# Altium schematic sheet System Power Supply.SchDoc
size A4
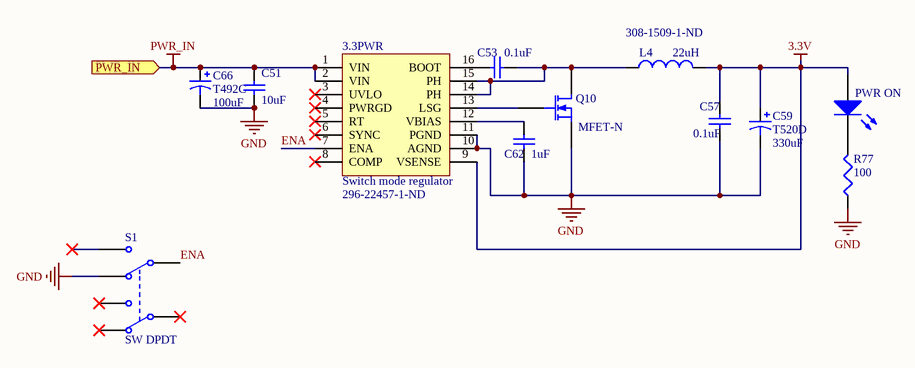
[diagram p0: System Power Supply.SchDoc]

## Parts
3.3PWR  Switch mode regulator  [TSOP65P640X120_HS-16N]
C51  value 10uF  [0603_CAP]  (hidden comment: X7R Cap)
C53  value 0.1uF  [0603_CAP]  (hidden comment: X7R Cap)
C57  value 0.1uF  [0603_CAP]  (hidden comment: X7R Cap)
C59  T520D  value 330uF  [D]
C62  value 1uF  [0603_CAP]  (hidden comment: X7R Cap)
C66  T492C  value 100uF  [C]
L4  value 22uH  Supplier Part Number 2: 308-1509-1-ND  [INDM7575X45N]  (hidden comment: Inductor)
PWR_ON  LED0  [0603_RES]  (value not drawn)
Q10  MFET-N  [CSD16321Q5]
R77  value 100  [0603_RES]  (hidden comment: Rpull)
S1  SW DPDT  [SPDT]

## Ports
PWR_IN (in)

## Nets
3.3V: 3.3PWR.9(VSENSE) C57.2 C59.1 L4.2 PWR_ON.1(A)
GND: 3.3PWR.10(AGND) 3.3PWR.11(PGND) C51.1 C57.1 C59.2 C62.2 C66.2 Q10.3(S) R77.1 S1.4(NC2)
PWR_IN: 3.3PWR.1(VIN) 3.3PWR.2(VIN) C51.2 C66.1 ; port PWR_IN
ENA: 3.3PWR.7(ENA) S1.5(COMMON2)
Net3.3PWR_12: 3.3PWR.12(VBIAS) C62.1
Net3.3PWR_13: 3.3PWR.13(LSG) Q10.2(G)
Net3.3PWR_14: 3.3PWR.14(PH) 3.3PWR.15(PH) C53.1 L4.1 Q10.1(D)
Net3.3PWR_16: 3.3PWR.16(BOOT) C53.2
NetPWR_ON_2: PWR_ON.2(K) R77.2

Not connected (* = marked no-connect by the designer): 3.3PWR 3(UVLO)* 4(PWRGD)* 5(RT)* 6(SYNC)* 8(COMP)*; S1 1(COMMON1)* 2(NC1)* 3(NO1)* 6(NO2)*

## Library data of the parts
3.3PWR = TPS54356: 296-22457-1-ND; Manufacturer: Texas Instruments; Manufacturer Part Number: TPS54356MPWPREP; Description: IC BUCK SYNC 3.3V 3A 16HTSSOP; Output Type: Fixed; Number of Outputs: 1; Voltage - Output: 3.3V; Voltage - Input: 5.5 V ~ 20 V; Frequency - Switching: 250kHz, 500kHz; Current - Output: 3A; Synchronous Rectifier: Yes; Supplier 1: Digi-Key; RoHS: RoHS Compliant; Category: Integrated Circuits (ICs); Stock 1: 4016; Pricing 1: 1=10.34, 25=8.58, 100=7.8, 250=7.02, 500=6.435, 1000=5.655 (USD); Type: Step-Down (Buck); PWM Type: -; Operating Temperature: -55°C ~ 125°C; Mounting Type: Surface Mount; Package / Case: 16-TSSOP (0.173", 4.40mm Width) Exposed pad; Packaging: Cut Tape (CT); Supplier Device Package: 16-HTSSOP; ComponentLink1URL: http://www.ti.com/lit/ds/symlink/tps54354-ep.pdf; ComponentLink1Description: http://www.ti.com/lit/ds/symlink/tps54354-ep.pdf; Supplier Part Number 1: 296-22457-1-ND
C51 C53 C57 C62 = Cap: Capacitor; Published: 8-Jun-2000; LatestRevisionDate: 17-Jul-2002; LatestRevisionNote: Re-released for DXP Platform.; PackageReference: RAD-0.3; Publisher: Altium Limited
C59 = T520D: Polymer Tantalum Chip Capacitor, T520 Series - KO-CAP Polymer; Published: 17-Jul-2002; LatestRevisionDate: 19-Mar-2004; LatestRevisionNote: Silkscreen dimensions re-sized.; DatasheetDocument: Mar-2001; PackageDocument: Mar-2001; PackageReference: D; Publisher: Altium Limited; Code_JEITA: 7343-31; ComponentLink1Description: Manufacturer Link; ComponentLink1URL: http://www.kemet.com/; ComponentLink2Description: Datasheet; ComponentLink2URL: http://www.kemet.com/kemet/web/homepage/kechome.nsf/vapubfilesname/F3102TA.pdf/$file/F3102TA.pdf
C66 = T492C: Solid Tantalum Chip Capacitor, T492 Series - CWR11 Style Per Mil-PRF-55365/8; Manufacturer: Kemet; Manufacturer Part Number: T491C107K016ZT; Description: CAP TANT 100UF 16V 10% 2312; Capacitance: 100µF; Voltage - Rated: 16V; Tolerance: ±10%; ESR (Equivalent Series Resistance): 1.000 Ohm; Type: Molded; Published: 17-Jul-2002; LatestRevisionDate: 19-Mar-2004; LatestRevisionNote: Silkscreen dimensions re-sized.; DatasheetDocument: Mar-2001; PackageDocument: Mar-2001; PackageReference: C; Publisher: Altium Limited; Code_JEITA: 6032-28; ComponentLink1Description: Manufacturer Link; ComponentLink1URL: http://www.kemet.com/; ComponentLink2Description: Datasheet; ComponentLink2URL: http://www.kemet.com/kemet/web/homepage/kechome.nsf/vapubfilesname/F3102TA.pdf/$file/F3102TA.pdf; Supplier 1: Digi-Key; Supplier Part Number 1: 399-5214-1-ND; RoHS: RoHS Compliant; Category: Capacitors; Stock 1: 83455; Pricing 1: 1=1.34, 10=1.117, 25=0.9624, 100=0.8197, 250=0.7128 (USD); Operating Temperature: -55°C ~ 125°C; Mounting Type: Surface Mount; Package / Case: 2312 (6032 Metric); Size / Dimension: 0.236" L x 0.126" W (6.00mm x 3.20mm); Height - Seated (Max): 0.110" (2.80mm); Lead Spacing: -; Manufacturer Size Code: C; Features: General Purpose; Packaging: Cut Tape (CT); Lifetime @ Temp.: -; ComponentLink3URL: http://www.kemet.com/datasheets&T491C107K016ZT; ComponentLink3Description: http://www.kemet.com/datasheets&T491C107K016ZT
L4 = Inductor: Manufacturer: SUMIDA AMERICA COMPONENTS INC; Manufacturer Part Number: CDRH74NP-150MC; Code_IEC: 1005; Description: POWER INDUCTOR 15UH 1.47A SMD; Inductance: 15µH; Current: 1.47A; Tolerance: ±20%; Shielding: Shielded; DC Resistance (DCR): 81 mOhm Max; Frequency - Test: 100kHz; Published: 8-Jun-2000; LatestRevisionDate: 29-May-2009; LatestRevisionNote: IPC-7351 Footprint Added.; PackageReference: 0402-A; Publisher: Altium Limited; PackageDescription: Chip Inductor; Code_JEITA: 0402; Supplier 1: Digi-Key; RoHS: RoHS Compliant; Category: Inductors, Coils, Chokes; Stock 1: 4240; Pricing 1: 1=1.42, 10=1.29, 50=1.16, 100=0.96, 250=0.8 (USD); Current - Saturation: -; Current - Temperature Rise: -; Type: -; Q @ Freq: -; Frequency - Self Resonant: -; Package / Case: 0.295" L x 0.295" W x 0.177" H (7.50mm x 7.50mm x 4.50mm); Mounting Type: Surface Mount; Packaging: Cut Tape (CT); Operating Temperature: -; Material - Core: -; Applications: Power Supplies; ComponentLink1URL: http://www.sumida.com/products/pdf/CDRH74.pdf; ComponentLink1Description: http://www.sumida.com/products/pdf/CDRH74.pdf
PWR_ON = LED0: Typical INFRARED GaAs LED; Published: 8-Jun-2000; LatestRevisionDate: 08-Jul-2005; LatestRevisionNote: Mech Layer 1 removed.; PackageReference: LED-0; Publisher: Altium Limited
Q10 = MOSFET-N: N-Channel MOSFET; Published: 8-Jun-2000; LatestRevisionDate: 17-Jul-2002; LatestRevisionNote: Re-released for DXP Platform.; PackageVersion: 1995/1996; PackageReference: E3; Publisher: Altium Limited
R77 = Rpull: Resistor; Published: 8-Jun-2000; LatestRevisionDate: 29-May-2009; LatestRevisionNote: IPC-7351 Footprint Added.; PackageReference: J1-0603; Publisher: Altium Limited; PackageDescription: Chip Resistor
S1 = SW DPDT: Switch; Manufacturer: C&K Components; Manufacturer Part Number: JS202011SCQN; Description: SWITCH SLIDE DPDT 6VDC 0.3A SMT; Switch Function: On-On; Contact Rating @ Voltage: 0.3A @ 6VDC; Actuator Type: Standard; Published: 24-Mar-1999; LatestRevisionDate: 29-May-2009; LatestRevisionNote: IPC-7351 Footprint Added.; PackageVersion: Mar-2001; PackageReference: SOT23-6; Publisher: Altium Limited; PackageDescription: 6-Pin SOT-23 Package 0.95 mm Pitch, 2.7 mm Lead Span; Code_JEITA: SC-74; Code_IPC: SOT26A-6; Supplier 1: Digi-Key; Supplier Part Number 1: 401-2002-1-ND; RoHS: RoHS Compliant; Category: Switches; Stock 1: 14690; Pricing 1: 1=0.56, 10=0.525, 25=0.4724, 50=0.4198, 100=0.4023, 250=0.36728, 500=0.3498 (USD); Circuit: DPDT; Mounting Type: Surface Mount; Orientation: Vertical; Termination Style: PC Pin; ComponentLink1URL: http://www.ck-components.com/index.php?module=media&action=Display&cmpref=14398&lang=en&width=&height=&format=&alt=; ComponentLink1Description: http://www.ck-components.com/index.php?module=media&action=Display&cmpref=14398&lang=en&width=&height=&format=&alt=